# EAGLE design hpctrl (EAGLE 9.6.2)
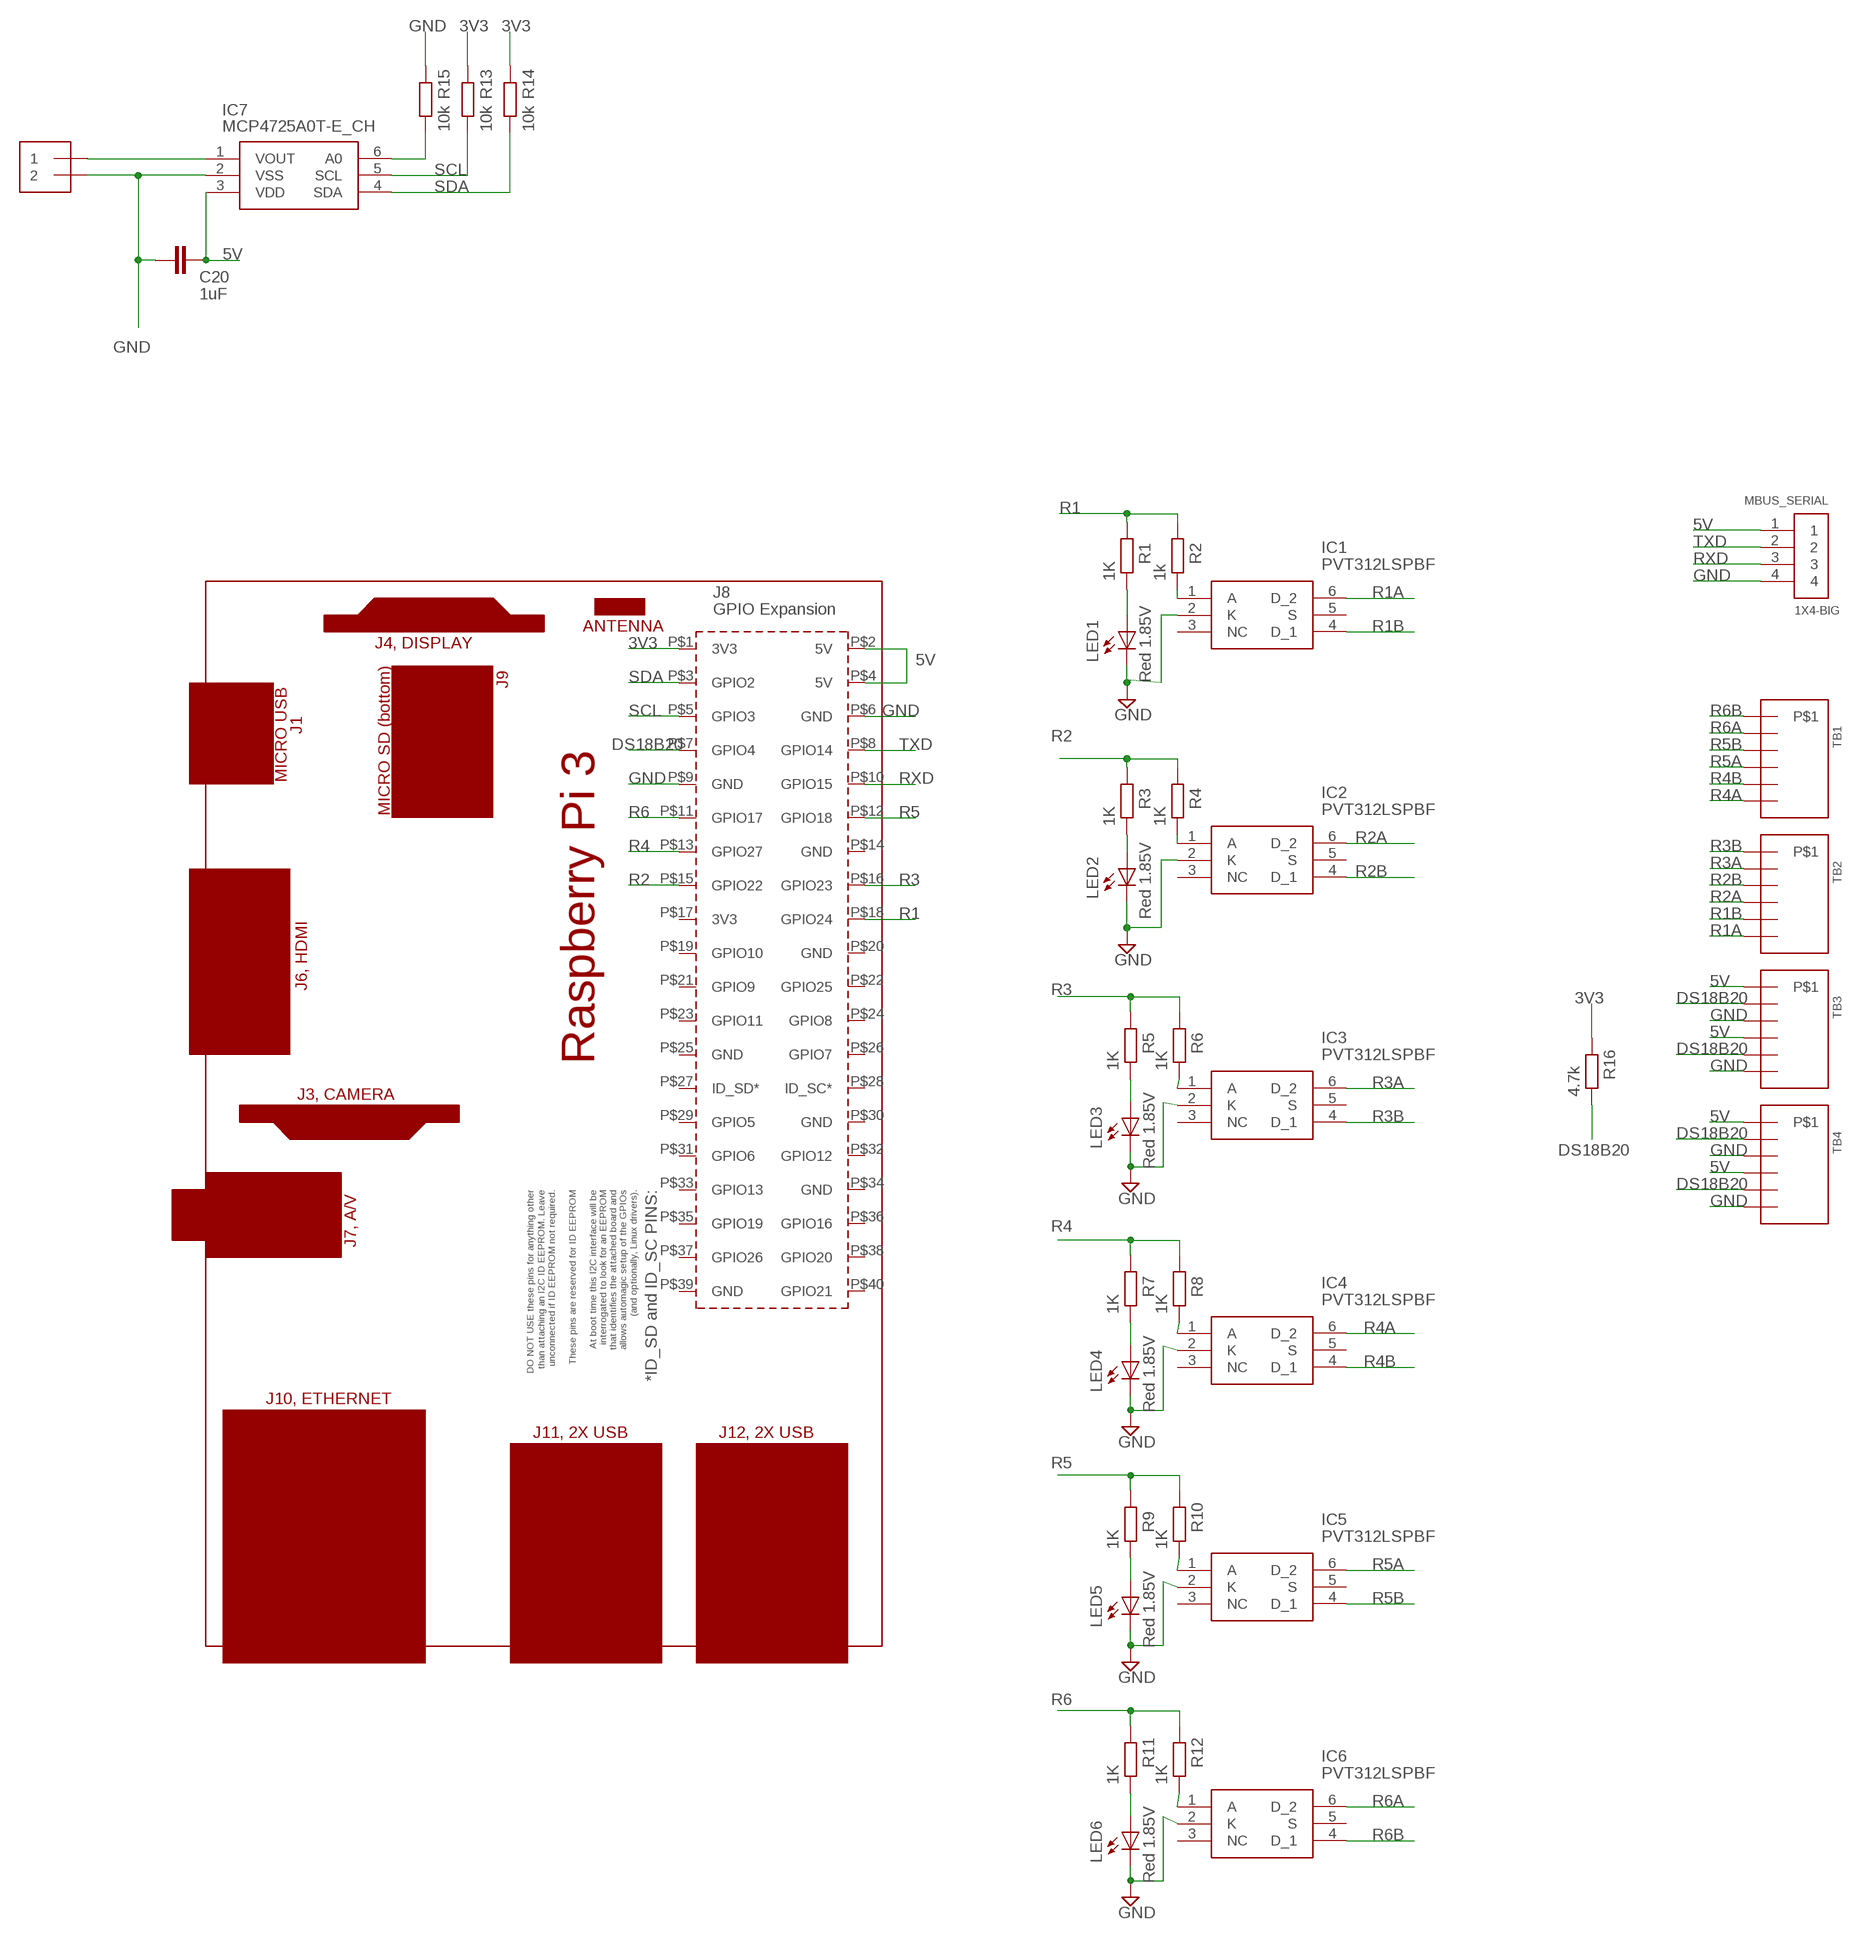
[diagram p0: schematic, sheet 1]

## Parts
C20  1uF  C-EUC0805  [C0805]
IC1  PVT312LSPBF  [SOP254P978X342-6N]
IC2  PVT312LSPBF  [SOP254P978X342-6N]
IC3  PVT312LSPBF  [SOP254P978X342-6N]
IC4  PVT312LSPBF  [SOP254P978X342-6N]
IC5  PVT312LSPBF  [SOP254P978X342-6N]
IC6  PVT312LSPBF  [SOP254P978X342-6N]
IC7  MCP4725A0T-E_CH  [SOT95P270X145-6N]
J1  1X2-3.5MM  [1X2-3.5MM]
LED1  Red 1.85V  LEDCHIP-LED0805  [CHIP-LED0805]
LED2  Red 1.85V  LEDCHIP-LED0805  [CHIP-LED0805]
LED3  Red 1.85V  LEDCHIP-LED0805  [CHIP-LED0805]
LED4  Red 1.85V  LEDCHIP-LED0805  [CHIP-LED0805]
LED5  Red 1.85V  LEDCHIP-LED0805  [CHIP-LED0805]
LED6  Red 1.85V  LEDCHIP-LED0805  [CHIP-LED0805]
MBUS_SERIAL  1X4-BIG  [1X04-BIG]
PCB1  RPI3RPI3  [RPI3]
R1  1K  R-EU_R0603  [R0603]
R2  1k  R-EU_R0603  [R0603]
R3  1K  R-EU_R0603  [R0603]
R4  1K  R-EU_R0603  [R0603]
R5  1K  R-EU_R0603  [R0603]
R6  1K  R-EU_R0603  [R0603]
R7  1K  R-EU_R0603  [R0603]
R8  1K  R-EU_R0603  [R0603]
R9  1K  R-EU_R0603  [R0603]
R10  1K  R-EU_R0603  [R0603]
R11  1K  R-EU_R0603  [R0603]
R12  1K  R-EU_R0603  [R0603]
R13  10k  R-EU_R0603  [R0603]
R14  10k  R-EU_R0603  [R0603]
R15  10k  R-EU_R0603  [R0603]
R16  4.7k  R-EU_R0603  [R0603]
TB1  3.5MM_TB_X6  [3.5MM_X6]
TB2  3.5MM_TB_X6  [3.5MM_X6]
TB3  3.5MM_TB_X6  [3.5MM_X6]
TB4  3.5MM_TB_X6  [3.5MM_X6]

## Nets
3V3: PCB1.P$1(3V3) R13.2 R14.2 R16.2
5V: C20.1 IC7.3(VDD) MBUS_SERIAL.1 PCB1.P$2(5V) PCB1.P$4(5V) TB3.P$1 TB3.P$4 TB4.P$1 TB4.P$4
DS18B20: PCB1.P$7(GPIO4) R16.1 TB3.P$2 TB3.P$5 TB4.P$2 TB4.P$5
GND [power]: C20.2 IC1.2(K) IC2.2(K) IC3.2(K) IC4.2(K) IC5.2(K) IC6.2(K) IC7.2(VSS) J1.2 LED1.C LED2.C LED3.C LED4.C LED5.C LED6.C MBUS_SERIAL.4 PCB1.P$6(GND) PCB1.P$9(GND) R15.2 TB3.P$3 TB3.P$6 TB4.P$3 TB4.P$6
N$1: IC1.1(A) R2.1
N$2: IC7.1(VOUT) J1.1
N$3: LED2.A R3.1
N$4: IC2.1(A) R4.1
N$6: LED3.A R5.1
N$7: IC3.1(A) R6.1
N$9: LED4.A R7.1
N$10: IC4.1(A) R8.1
N$12: LED5.A R9.1
N$13: IC5.1(A) R10.1
N$15: LED6.A R11.1
N$16: IC6.1(A) R12.1
N$20: IC7.6(A0) R15.1
N$41: LED1.A R1.1
R1: PCB1.P$18(GPIO24) R1.2 R2.2
R1A: IC1.6(D_2) TB2.P$6
R1B: IC1.4(D_1) TB2.P$5
R2: PCB1.P$15(GPIO22) R3.2 R4.2
R2A: IC2.6(D_2) TB2.P$4
R2B: IC2.4(D_1) TB2.P$3
R3: PCB1.P$16(GPIO23) R5.2 R6.2
R3A: IC3.6(D_2) TB2.P$2
R3B: IC3.4(D_1) TB2.P$1
R4: PCB1.P$13(GPIO27) R7.2 R8.2
R4A: IC4.6(D_2) TB1.P$6
R4B: IC4.4(D_1) TB1.P$5
R5: PCB1.P$12(GPIO18) R9.2 R10.2
R5A: IC5.6(D_2) TB1.P$4
R5B: IC5.4(D_1) TB1.P$3
R6: PCB1.P$11(GPIO17) R11.2 R12.2
R6A: IC6.6(D_2) TB1.P$2
R6B: IC6.4(D_1) TB1.P$1
RXD: MBUS_SERIAL.3 PCB1.P$10(GPIO15)
SCL: IC7.5(SCL) PCB1.P$5(GPIO3) R13.1
SDA: IC7.4(SDA) PCB1.P$3(GPIO2) R14.1
TXD: MBUS_SERIAL.2 PCB1.P$8(GPIO14)
Unconnected: IC1.3(NC) IC1.5(S) IC2.3(NC) IC2.5(S) IC3.3(NC) IC3.5(S) IC4.3(NC) IC4.5(S) IC5.3(NC) IC5.5(S) IC6.3(NC) IC6.5(S) PCB1.P$14(GND) PCB1.P$17(3V3) PCB1.P$19(GPIO10) PCB1.P$20(GND) PCB1.P$21(GPIO9) PCB1.P$22(GPIO25) PCB1.P$23(GPIO11) PCB1.P$24(GPIO8) PCB1.P$25(GND) PCB1.P$26(GPIO7) PCB1.P$27(ID_SD*) PCB1.P$28(ID_SC*) PCB1.P$29(GPIO5) PCB1.P$30(GND) PCB1.P$31(GPIO6) PCB1.P$32(GPIO12) PCB1.P$33(GPIO13) PCB1.P$34(GND) PCB1.P$35(GPIO19) PCB1.P$36(GPIO16) PCB1.P$37(GPIO26) PCB1.P$38(GPIO20) PCB1.P$39(GND) PCB1.P$40(GPIO21)

## Library data of the parts
C20 = rcl:C-EU: CAPACITOR, European symbol; SPICEPREFIX: C
IC1-IC6 = PVT312LSPBF:PVT312LSPBF: Infineon PVT312LSPBF AC/DC Input, MOSFET Output Optocoupler, Surface Mount, 6-Pin DIP Source: Datasheet <https://www.infineon.com/dgdl/pvt312.pdf?fileId=5546d462533600a4015356841f1c2960>; ARROW_PART_NUMBER: PVT312LSPBF; ARROW_PRICE-STOCK: https://www.arrow.com/en/products/pvt312lspbf/infineon-technologies-ag; DESCRIPTION: Infineon PVT312LSPBF AC/DC Input, MOSFET Output Optocoupler, Surface Mount, 6-Pin DIP; HEIGHT: 3.42mm; MANUFACTURER_NAME: Infineon; MANUFACTURER_PART_NUMBER: PVT312LSPBF; MOUSER_PART_NUMBER: 942-PVT312LSPBF; MOUSER_PRICE-STOCK: https://www.mouser.co.uk/ProductDetail/Infineon-IR/PVT312LSPBF?qs=Z8%252BeY1k3TIKsRqQcCXmMog%3D%3D
IC7 = MCP4725A0T-E_CH:MCP4725A0T-E_CH: D/A Converter 12-Bit EEPROM I2C SOT23-6 Source: Datasheet <http://ww1.microchip.com/downloads/en/DeviceDoc/22039d.pdf>; ARROW_PART_NUMBER: MCP4725A0T-E/CH; ARROW_PRICE-STOCK: https://www.arrow.com/en/products/mcp4725a0t-ech/microchip-technology; DESCRIPTION: D/A Converter 12-Bit EEPROM I2C SOT23-6; HEIGHT: 1.45mm; MANUFACTURER_NAME: Microchip; MANUFACTURER_PART_NUMBER: MCP4725A0T-E/CH; MOUSER_PART_NUMBER: 579-MCP4725A0TECH; MOUSER_PRICE-STOCK: https://www.mouser.co.uk/ProductDetail/Microchip-Technology/MCP4725A0T-E-CH?qs=vkMqrgFpRajeQECZ3goc0A%3D%3D
J1 = adafruit:1X2: 3.5mm Terminal block http://www.ladyada.net/library/pcb/eaglelibrary.html
LED1-LED6 = adafruit:LED: LED OSRAM: - CHIPLED LG R971, LG N971, LY N971, LG Q971, LY Q971, LO R971, LY R971 LH N974, LH R974 LS Q976, LO Q976, LY Q976 LO Q996 - Hyper CHIPLED LW Q18S LB Q993, LB Q99A, LB R99A - SideLED LS A670, LO A670, LY A670, LG A670, LP A670 LB A673, LV A673, LT A673, LW A673 LH A674 LY A675 LS A676, LA A676, LO A676, LY A676, LW A676 LS A679, LY A679, LG A679 - Hyper Micro SIDELED® LS Y876, LA Y876, LO Y876, LY Y876 LT Y87S - SmartLED LW L88C, LW L88S LB L89C, LB L89S, LG L890 LS L89K, LO L89K, LY L89K LS L896, LA L896, LO L896, LY L896 - TOPLED LS T670, LO T670, LY T670, LG T670, LP T670 LSG T670, LSP T670, LSY T670, LOP T670, LYG T670 LG T671, LOG T671, LSG T671 LB T673, LV T673, LT T673, LW T673 LH T674 LS T676, LA T676, LO T676, LY T676, LB T676, LH T676, LSB T676, LW T676 LB T67C, LV T67C, LT T67C, LS T67K, LO T67K, LY T67K, LW E67C LS E67B, LA E67B, LO E67B, LY E67B, LB E67C, LV E67C, LT E67C LW T67C LS T679, LY T679, LG T679 LS T770, LO T770, LY T770, LG T770, LP T770 LB T773, LV T773, LT T773, LW T773 LH T774 LS E675, LA E675, LY E675, LS T675 LS T776, LA T776, LO T776, LY T776, LB T776 LHGB T686 LT T68C, LB T68C - Hyper Mini TOPLED® LB M676 - Mini TOPLED Santana® LG M470 LS M47K, LO M47K, LY M47K Source: http://www.osram.convergy.de/
MBUS_SERIAL = adafruit:1X4: 4-pin connector
PCB1 = e14_Rpi3_RevA+mirror-pcb:RPI3: Device for Raspberry Pi 3 board created by Dave Young for www.element14.com More information and support community is available at https://www.element14.com/community/community/raspberry-pi Device for Raspberry Pi 3 board updated by Gerald Schwarz for www.element14.com On RPI3 addet the layer milling and created a mirrored shield.
R1-R16 = rcl:R-EU_: RESISTOR, European symbol
TB1-TB4 = 3.5mm terminal block rs pro:3.5MM_TB_X6

## Net classes
0 default: width 0.203 mm, drill 0.6 mm, clearance 0.203 mm
1 power: width 0.381 mm, drill 0.6 mm, clearance 0.254 mm
2 gnd: width 0.254 mm, drill 0.5 mm, clearance 0.152 mm

## Board
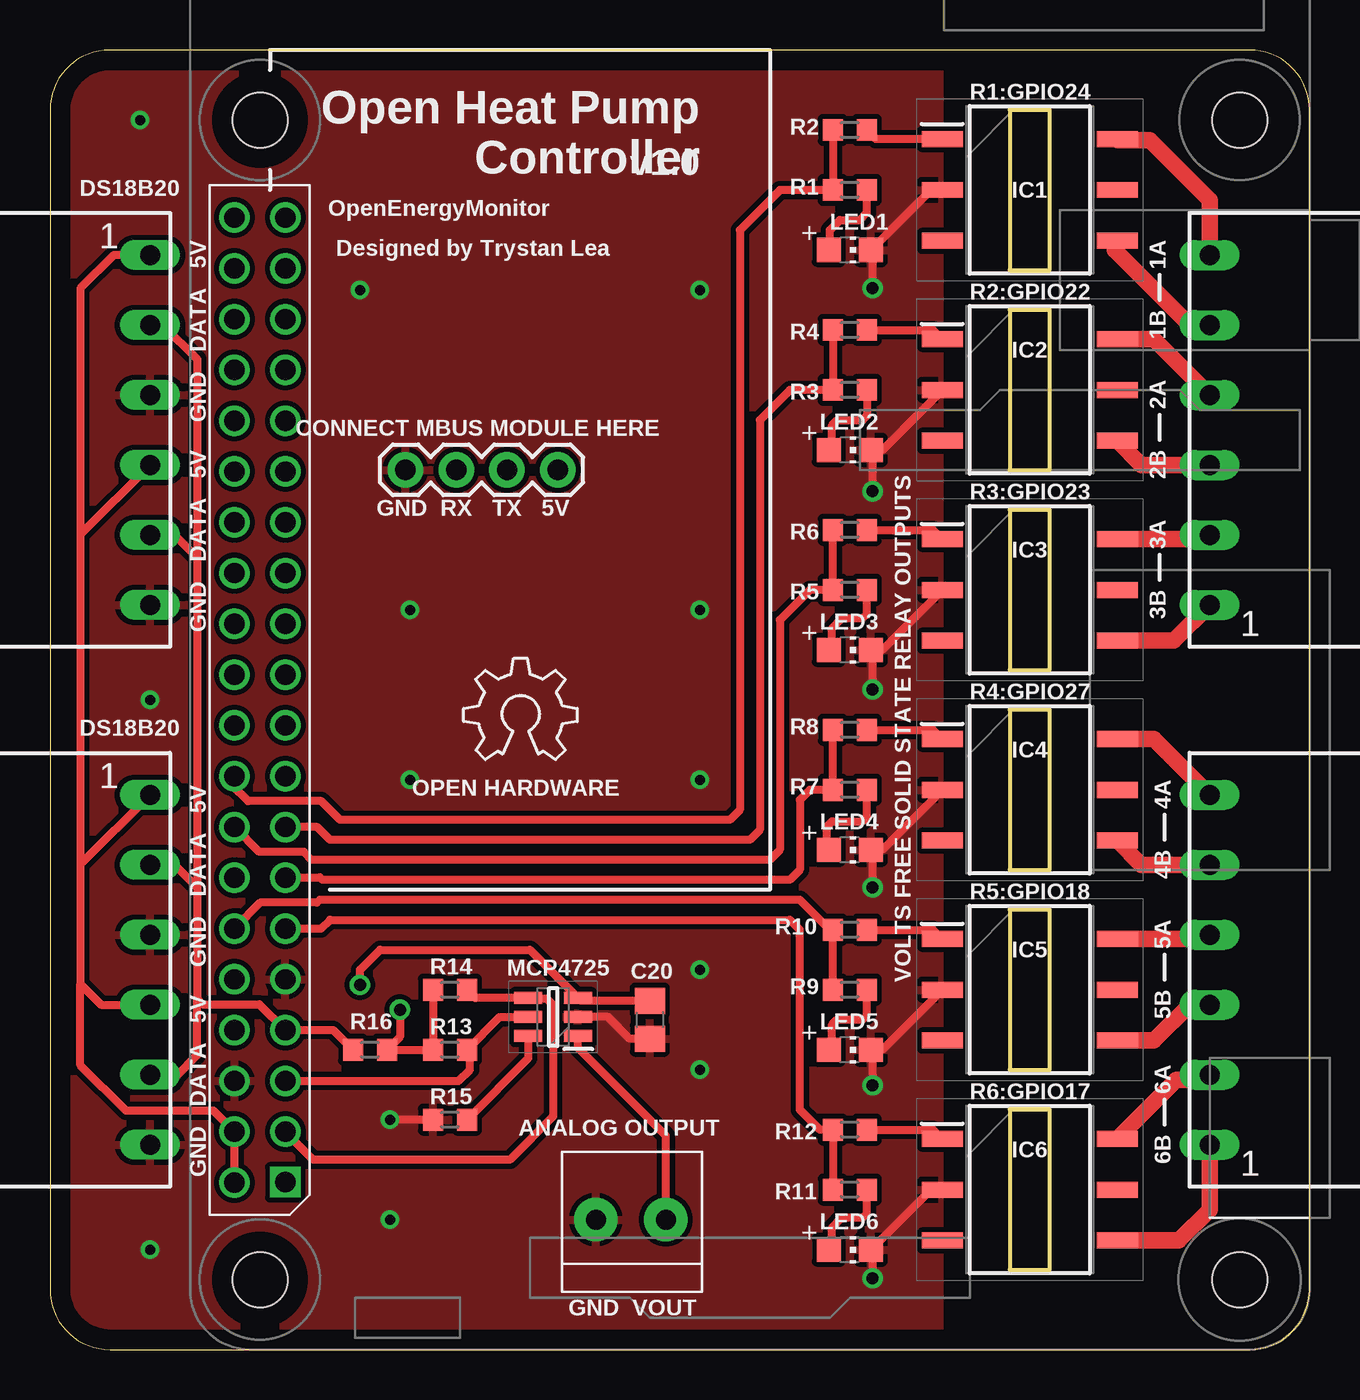
[diagram p1: board, top side]
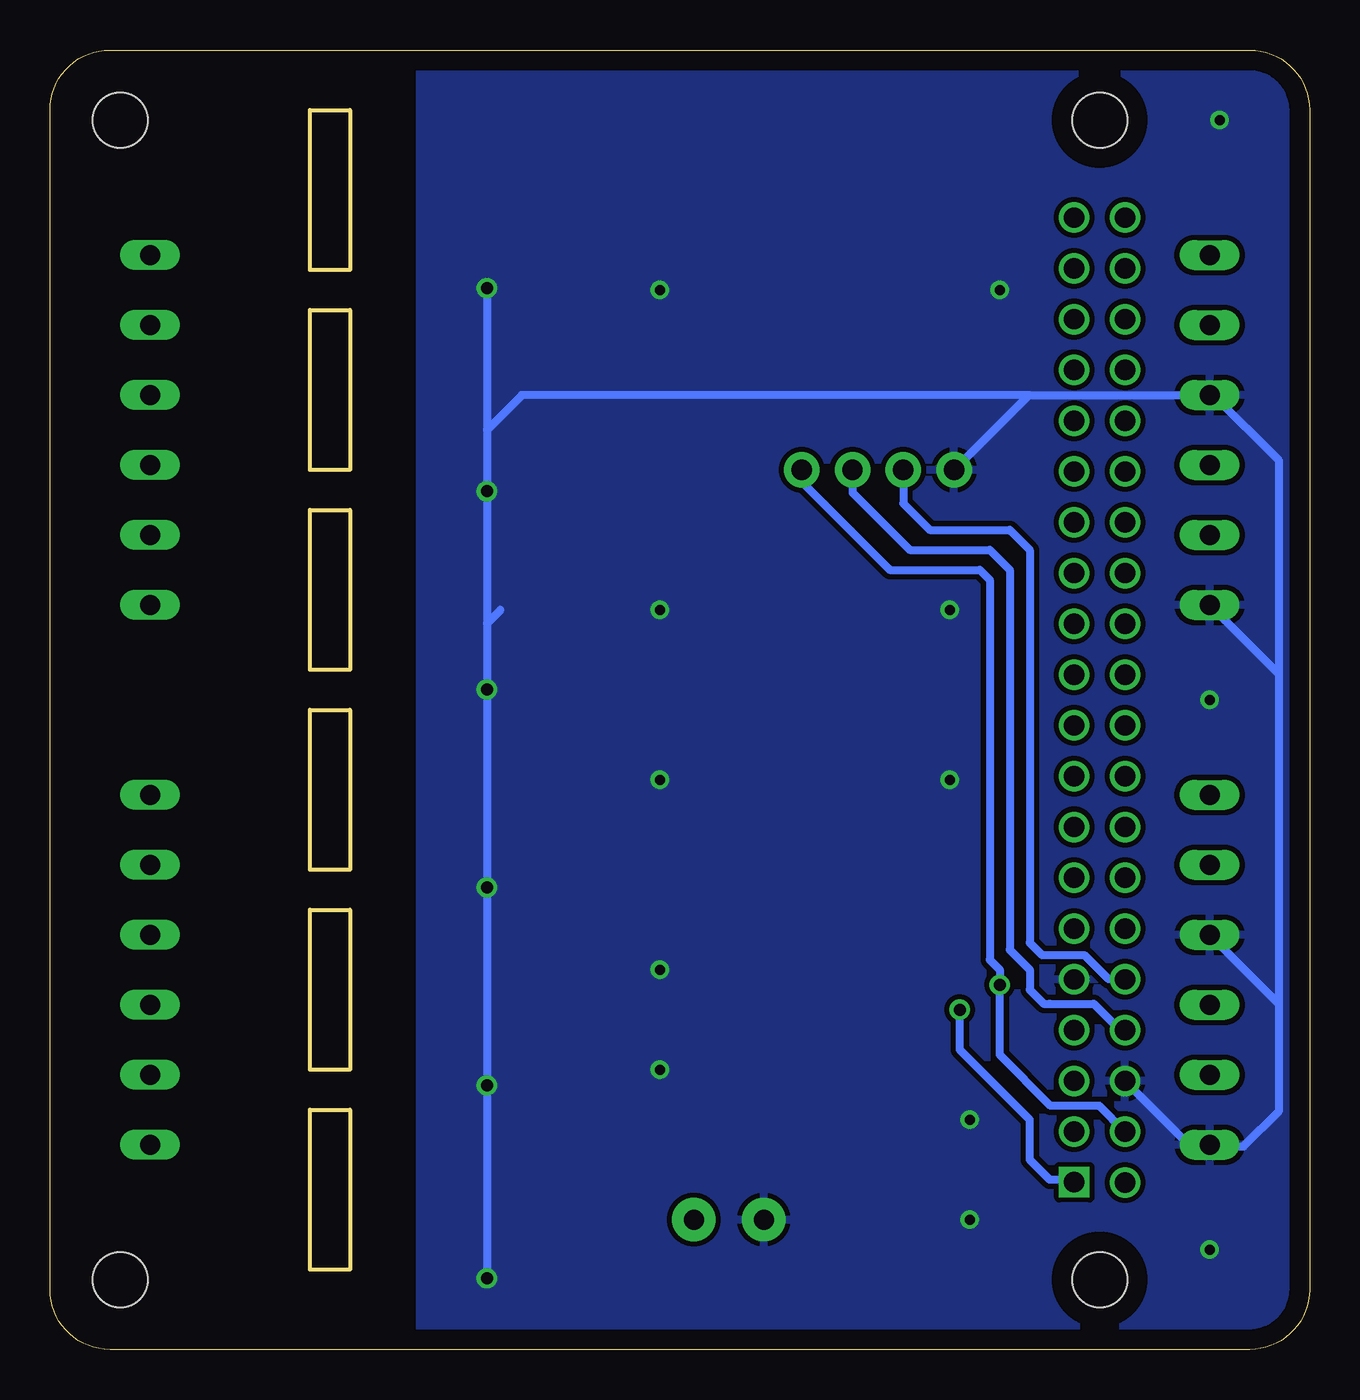
[diagram p2: board, bottom side, seen from below]

Size 63 x 65 mm. Coordinates in mm from the lower left corner, seen from the top.
Outline: 0,62 0,3 arc90 3,0 60,0 arc90 63,3 63,62 arc90 60,65 3,65 arc90 0,62
Copper layers (1*16): Top 0.035mm / dielectric 1.5mm / Bottom 0.035mm
Design rules "default *": minimum track width 6mil, minimum drill 0.35mm, track to track 6mil, track to pad 6mil, pad to pad 6mil, via to via 6mil, smd to smd 6mil, copper to edge 40mil, drill to drill 6mil, minimum pad ring 10mil, minimum via ring 8mil, stop-mask expansion 4mil, vias tented up to drill 0.6mm, thermal gap 10mil
Milling: 24 lines

### Footprints (pad centres in the part's own frame; a part is rotated, then mirrored left to right if it is on the bottom)
C0805 = smd 1.3 x 1.5: 1 -0.95,0; 2 0.95,0
SOP254P978X342-6N = smd 2.05 x 0.8: 1 -4.375,2.54; 2 -4.375,0; 3 -4.375,-2.54; 4 4.375,-2.54; 5 4.375,0; 6 4.375,2.54
SOT95P270X145-6N = smd 1.4 x 0.6: 1 -1.25,0.95; 2 -1.25,0; 3 -1.25,-0.95; 4 1.25,-0.95; 5 1.25,0; 6 1.25,0.95
1X2-3.5MM = drill 1 pad 2.184: 1 1.8,0; 2 -1.7,0
CHIP-LED0805 = smd 1.2 x 1.2: A 0,-1.05; C 0,1.05
1X04-BIG = drill 1.016 pad 1.778: 1 0,0; 2 2.54,0; 3 5.08,0; 4 7.62,0
RPI3 = drill 1.016 square: P$1 8.37,51.23 | drill 1.016: P$2 8.357,53.772; P$3 10.897,51.232; P$4 10.897,53.772; P$5 13.437,51.232; P$6 13.437,53.772; P$7 15.977,51.232; P$8 15.977,53.772; P$9 18.517,51.232; P$10 18.517,53.772; P$11 21.057,51.232; P$12 21.057,53.772; P$13 23.597,51.232; P$14 23.597,53.772; P$15 26.137,51.232; P$16 26.137,53.772; P$17 28.677,51.232; P$18 28.677,53.772; P$19 31.217,51.232; P$20 31.217,53.772; P$21 33.757,51.232; P$22 33.757,53.772; P$23 36.297,51.232; P$24 36.297,53.772; P$25 38.837,51.232; P$26 38.837,53.772; P$27 41.377,51.232; P$28 41.377,53.772; P$29 43.917,51.232; P$30 43.917,53.772; P$31 46.457,51.232; P$32 46.457,53.772; P$33 48.997,51.232; P$34 48.997,53.772; P$35 51.537,51.232; P$36 51.537,53.772; P$37 54.077,51.232; P$38 54.077,53.772; P$39 56.617,51.232; P$40 56.617,53.772 | hole 2.75: 3.5,3.5; 61.5,3.5; 3.5,52.5; 61.5,52.5
R0603 = smd 1 x 1.1: 1 -0.85,0; 2 0.85,0
3.5MM_X6 = drill 1 long: P$1 3,8.75; P$2 3,5.25; P$3 3,1.75; P$4 3,-1.75; P$5 3,-5.25; P$6 3,-8.75

### Placement (x,y rotation side)
C20  30,16.5 270 top
IC1  49,58 0 top
IC2  49,48 0 top
IC3  49,38 0 top
IC4  49,28 0 top
IC5  49,18 0 top
IC6  49,8 0 top
IC7  25.17,16.63 180 top
J1  29,6.5 0 top
LED1  40,55 270 top
LED2  40,45 270 top
LED3  40,35 270 top
LED4  40,25 270 top
LED5  40,15 270 top
LED6  40,5 270 top
LOGO2  OSHW_LOGO_6MILX0200-NT  [OSHW_6X200_NOTEXT]  20.7,29.5 0 top
MBUS_SERIAL  25.4,44 180 top
PCB1  63,0 90 top
R1  40,58 180 top
R2  40,61 180 top
R3  40,48 180 top
R4  40,51 180 top
R5  40,38 180 top
R6  40,41 180 top
R7  40,28 180 top
R8  40,31 180 top
R9  40,18 180 top
R10  40,21 180 top
R11  40,8 180 top
R12  40,11 180 top
R13  20,15 180 top
R14  20,18 180 top
R15  20,11.5 180 top
R16  16,15 0 top
TB1  61,19 180 top
TB2  61,46 180 top
TB3  2,19 0 top
TB4  2,46 0 top

### Tracks (layer width: path | path; a pad name or v marks a point on that pad's centre or on a via)
3V3  (via drill 0.6)
  Top 0.406: R14.2 R13.2 R16.2 17.5,15.65 v17.5,17
  Bottom 0.406: PCB1.P$1 11.9,8.5 13,8.5 14,9.5 14,11.5 17.5,15 v17.5,17
5V  (via drill 0.6)
  Top 0.406: C20.1 26.55,17.45 IC7.3 24,20 16.5,20 15.5,19 v15.5,18.25 | TB4.P$1 3.19,54.75 1.52,53.09 1.52,40.77 | 1.52,40.77 1.52,24.27 | 1.52,24.27 1.52,18.29 | 1.52,18.29 2.56,17.25 TB3.P$4 5.36,17.25 | PCB1.P$2 PCB1.P$4 8.19,11.94 3.81,11.94 1.52,14.22 1.52,18.29 | TB4.P$4 1.52,40.77 | TB3.P$1 1.52,24.27
  Bottom 0.406: MBUS_SERIAL.1 25.4,43.4 21,39 16.5,39 16,38.5 16,19.5 15.5,19 v15.5,18.25 | 15.5,17.79 v15.5,18.25 | PCB1.P$4 10.52,12.19 12.95,12.19 15.5,14.74 v15.5,18.25
DS18B20
  Top 0.406: TB4.P$2 5.65,51.25 7.37,49.53 7.37,39.62 | 7.37,39.62 7.37,23.11 | 7.37,23.11 7.37,17.53 | 7.37,17.53 7.62,17.27 10.47,17.27 PCB1.P$7 14.17,15.98 R16.1 | TB4.P$5 6.24,40.75 7.37,39.62 | TB3.P$2 6.23,24.25 7.37,23.11 | TB3.P$5 6.32,13.75 6.35,13.72 7.37,14.73 7.37,17.53
GND  (via drill 0.5, 0.6)
  Top 0.406: C20.2 29,15.55 27.92,16.63 IC7.2 | IC1.2 44.05,58 LED1.C 41.15,54.9 v41.15,53.09 | IC2.2 41.62,45 LED2.C 41.15,44.9 v41.15,42.93 | IC6.2 44.05,8 LED6.C 41.15,4.9 v41.15,3.56 | IC5.2 41.62,15 LED5.C 41.15,14.9 v41.15,13.21 | IC4.2 41.62,25 LED4.C 41.15,24.9 v41.15,23.11 | IC3.2 41.62,35 LED3.C 41.15,34.9 v41.15,33.02 | R15.2 v17,11.5
  Bottom 0.406: v41.15,53.09 41.15,46 | 41.15,46 v41.15,42.93 41.15,36.32 | 41.15,36.32 v41.15,33.02 v41.15,23.11 v41.15,13.21 v41.15,3.56 | 40.47,37 41.15,36.32 | 1.52,17.27 1.52,11.94 3.3,10.16 4.91,10.16 TB3.P$6 6.04,10.25 PCB1.P$6 | 1.52,17.27 1.52,33.77 | 1.52,33.77 1.52,44.45 4.82,47.75 TB4.P$3 14.03,47.75 | TB4.P$6 1.52,33.77 | TB3.P$3 1.52,17.27 | MBUS_SERIAL.4 14.03,47.75 | 14.03,47.75 39.4,47.75 41.15,46
  other vias: 15.5,53 32.5,53 32.5,28.5 18,28.5 18,37 4.5,61.5 32.5,37 32.5,19 17,6.5 32.5,14 5,32.5 5,5
  pour Top: 0,66 0,3 arc90 3,0 44.5,0 44.5,66
  pour Bottom: -1,-1 44.5,-1 44.5,66.5 -1,66.5
N$1
  Top 0.406: IC1.1 41.31,60.54 R2.1
N$2
  Top 0.406: J1.1 30.8,10.7 26.42,15.08 IC7.1
N$3
  Top 0.406: R3.1 40.89,47.96 40.89,46.74 40.64,46.48 39.37,46.48 39.12,46.23 39.12,45.17 LED2.A
N$4
  Top 0.406: R4.1 44.16,51 IC2.1
N$6
  Top 0.406: LED3.A 39.12,35.17 39.12,36.07 39.62,36.58 40.64,36.58 40.85,36.79 R5.1
N$7
  Top 0.406: R6.1 44.16,41 IC3.1
N$9
  Top 0.406: LED4.A 38.86,25.09 38.86,26.16 39.12,26.42 40.64,26.42 40.85,26.63 R7.1
N$10
  Top 0.406: R8.1 44.16,31 IC4.1
N$12
  Top 0.406: LED5.A 39.12,15.17 39.12,16.26 39.37,16.51 40.64,16.51 40.85,16.72 R9.1
N$13
  Top 0.406: R10.1 44.16,21 IC5.1
N$15
  Top 0.406: LED6.A 39.12,5.17 39.12,6.1 39.62,6.6 40.64,6.6 40.85,6.81 R11.1
N$16
  Top 0.406: R12.1 44.16,11 IC6.1
N$20
  Top 0.406: IC7.6 23.92,14.57 R15.1
N$41
  Top 0.406: LED1.A 39,55.05 39,56 39.5,56.5 40.5,56.5 40.85,56.85 R1.1
R1
  Top 0.406: R2.2 R1.2 36.5,58 34.5,56 34.5,27 34,26.5 14.5,26.5 13.57,27.43 9.91,27.43 9.14,28.19 9.14,28.59 PCB1.P$18
R1A
  Top 0.813: IC1.6 53.41,60.5 55,60.5 58,57.5 TB2.P$6
R1B
  Top 0.813: TB2.P$5 57,51.25 53.25,55 53.25,55.34 IC1.4
R2
  Top 0.406: R3.2 | R4.2 R3.2 | R3.2 37,48 35.5,46.5 35.5,26 35,25.5 14,25.5 13.36,26.14 PCB1.P$15
R2A
  Top 0.813: IC2.6 55.21,50.54 TB2.P$4
  Bottom 0.813: 57.25,47.75 TB2.P$4
R2B
  Top 0.813: TB2.P$3 54.59,44.25 IC2.4
R3
  Top 0.406: R6.2 R5.2 38,38 36.5,36.5 36.5,25 36,24.5 13.09,24.5 12.7,24.89 10.47,24.89 PCB1.P$16
R3A
  Top 0.813: IC3.6 57.79,40.54 TB2.P$2
R3B
  Top 0.813: TB2.P$1 56.21,35.46 IC3.4
R4
  Top 0.406: R8.2 R7.2 38,28 37.5,27.5 37.5,24 37,23.5 13.62,23.5 13.5,23.62 11.79,23.62 PCB1.P$13
R4A
  Top 0.813: IC4.6 55.21,30.54 TB1.P$6
R4B
  Top 0.813: TB1.P$5 54.59,24.25 IC4.4
R5
  Top 0.406: PCB1.P$12 10.52,22.35 13.35,22.35 13.5,22.5 37.5,22.5 39,21 R10.2 R9.2
R5A
  Top 0.813: IC5.6 57.79,20.54 TB1.P$4
R5B
  Top 0.813: TB1.P$3 57,17.25 55.21,15.46 IC5.4
R6
  Top 0.406: 11.79,21.08 PCB1.P$11 13.56,21.06 14,21.5 37,21.5 37.5,21 37.5,12 38.5,11 R12.2 R11.2
R6A
  Top 0.813: IC6.6 56.34,13.5 57.75,13.5 TB1.P$2
R6B
  Top 0.813: IC6.4 56.46,5.46 58,7 TB1.P$1
RXD
  Bottom 0.406: PCB1.P$10 10.04,18.52 11.26,19.74 13.39,19.74 14,20.35 14,40 15,41 19,41 20.32,42.32 MBUS_SERIAL.3
SCL
  Top 0.406: R13.1 22.48,16.63 IC7.5 | R13.1 20.85,14.85 | R13.1 21,14.85 21,14 20.44,13.44 PCB1.P$5
SDA
  Top 0.406: R14.1 21.27,17.58 IC7.4 23.96,17.55 24.87,17.55 25.17,17.24 25.17,11.67 23,9.5 13.16,9.5 PCB1.P$3
TXD
  Bottom 0.406: MBUS_SERIAL.2 22.86,42.86 20,40 16,40 15,39 15,20 14,19 14,18 13.3,17.3 13,17.3 10.8,17.3 9.48,15.98 PCB1.P$8

### Text on the board
tPlace: Change to connection type A!! for AC operation
tNames: Open Heat Pump / Controller | R1:GPIO24 | v1.0 | DS18B20 | OpenEnergyMonitor | GND DATA 5V | Designed by Trystan Lea | 1A | R2:GPIO22 | 1B | 2A | CONNECT MBUS MODULE HERE | GND DATA 5V | 2B | VOLTS FREE SOLID STATE RELAY OUTPUTS | GND RX TX 5V | R3:GPIO23 | 3A | 3B | DS18B20 | R4:GPIO27 | GND DATA 5V | OPEN HARDWARE | 4A | 4B | R5:GPIO18 | 5A | MCP4725 | GND DATA 5V | 5B | 6A | ANALOG OUTPUT | R6:GPIO17 | 6B | GND VOUT